# Altium schematic sheet AMU-S24-V00-CURRENTShutdownRelay.SchDoc: Shutdown Loop Relay
size A3; DrawnBy: Jonn DIllon; DocumentNumber: 13; SheetNumber: 24; SheetTotal: 29; Project: Shutdown Current Board 2020
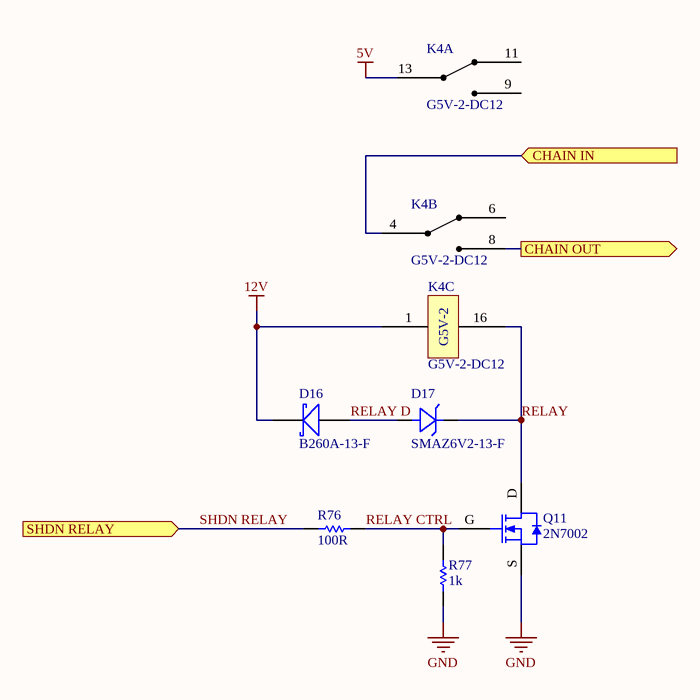
[diagram p0: AMU-S24-V00-CURRENTShutdownRelay.SchDoc]

## Parts
D16  B260A-13-F  [SMA]
D17  SMAZ6V2-13-F  [SMA]
K4  G5V-2-DC12  [G5V-2]  (parts A,B,C of 3)
Q11  2N7002  [SOT23-3]
R76  100R  [Res_ThinFilm_0603]
R77  1k  [Res_ThinFilm_0603]

## Ports
CHAIN IN (in), CHAIN OUT (out), SHDN RELAY (in)

## Nets
5V: K4.13
12V: D16.K K4.1
GND: Q11.S R77.1
CHAIN IN: K4.4 ; port CHAIN IN
CHAIN OUT: K4.8 ; port CHAIN OUT
RELAY: D17.K(Cathode) K4.16 Q11.D
RELAY CTRL: Q11.G R76.2 R77.2
RELAY D: D16.A D17.A(Anode)
SHDN RELAY: R76.1 ; port SHDN RELAY

Not connected (* = marked no-connect by the designer): K4 6 9 11

## Notes on the sheet
- Revision History:
- Sheet Title:
- Rev
- Date
- Description
- Project:
- Size:
- Drawn By:
- A3
- Number:
- Revision:
- Sheet
- Version:
- of
- QUT Motorsport
- O-120, Gardens Point
- 2 George Street
- Brisbane, QLD 4000
- Australia
- Print Date:
- Print Time:
- File Name:
- (in symbol G5V-2-DC12, part C) G5V-2

## Library data of the parts
D16 = B260A-13-F: Diode, Schottky Barrier Rectifier, 60 V, 2 A, B260A-13-F
D17 = SMAZ6V2-13-F: Zener Diode 6.2V 1W ±5% Surface Mount SMA; Manufacturer: Generic; MPN: 5V6 500mW SMA
K4 = G5V-2-DC12: General Purpose Relay DPDT (2 Form C) Through Hole, 12V, 2A
R76 = 100R 5%, 0603: Resistor, SMD, 100R, 0.1W, 5%, 0603
R77 = 1k 5% 0603: Resistor, SMD, 1k, 0.1W, 5%, 0603